# Altium schematic sheet Led Strip 2 colors.SchDoc
size A4
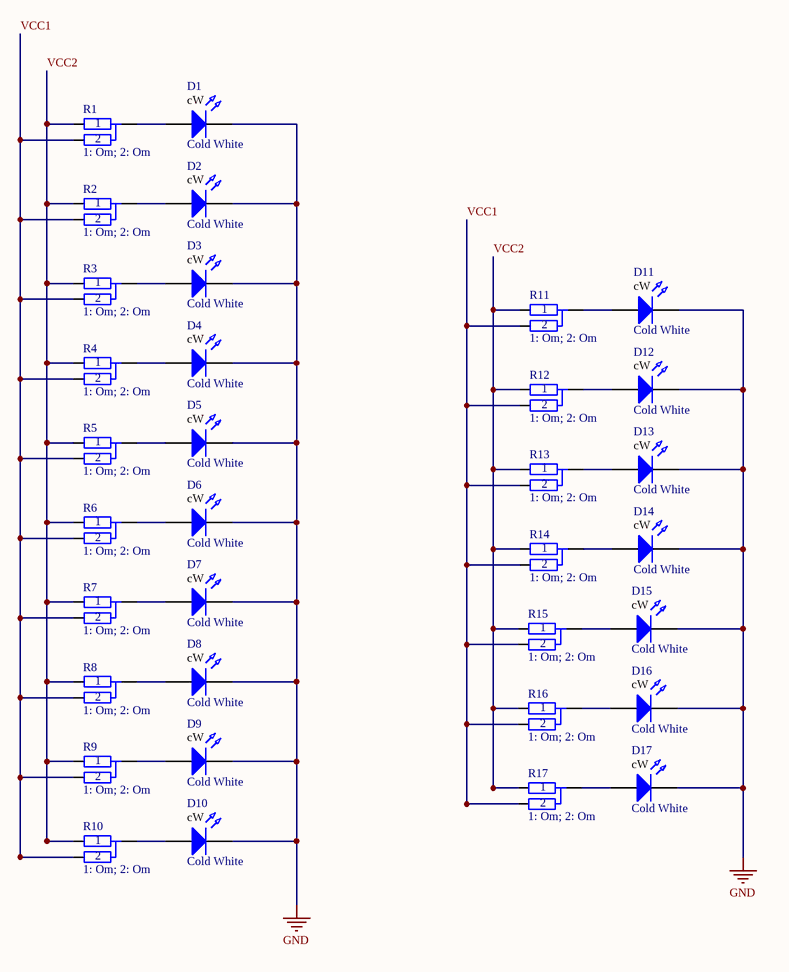
[diagram p0: Led Strip 2 colors.SchDoc]

## Parts
D1  Cold White  [LED SMD 5050 White compact R]
D2  Cold White  [LED SMD 5050 White compact R]
D3  Cold White  [LED SMD 5050 White compact R]
D4  Cold White  [LED SMD 5050 White compact R]
D5  Cold White  [LED SMD 5050 White compact R]
D6  Cold White  [LED SMD 5050 White compact R]
D7  Cold White  [LED SMD 5050 White compact R]
D8  Cold White  [LED SMD 5050 White compact R]
D9  Cold White  [LED SMD 5050 White compact R]
D10  Cold White  [LED SMD 5050 White compact R]
D11  Cold White  [LED SMD 5050 White compact R]
D12  Cold White  [LED SMD 5050 White compact R]
D13  Cold White  [LED SMD 5050 White compact R]
D14  Cold White  [LED SMD 5050 White compact R]
D15  Cold White  [LED SMD 5050 White compact R]
D16  Cold White  [LED SMD 5050 White compact R]
D17  Cold White  [LED SMD 5050 White compact R]
R1  1: Om; 2: Om  [SMD 0805 (2012) Double]
R2  1: Om; 2: Om  [SMD 0805 (2012) Double]
R3  1: Om; 2: Om  [SMD 0805 (2012) Double]
R4  1: Om; 2: Om  [SMD 0805 (2012) Double]
R5  1: Om; 2: Om  [SMD 0805 (2012) Double]
R6  1: Om; 2: Om  [SMD 0805 (2012) Double]
R7  1: Om; 2: Om  [SMD 0805 (2012) Double]
R8  1: Om; 2: Om  [SMD 0805 (2012) Double]
R9  1: Om; 2: Om  [SMD 0805 (2012) Double]
R10  1: Om; 2: Om  [SMD 0805 (2012) Double]
R11  1: Om; 2: Om  [SMD 0805 (2012) Double]
R12  1: Om; 2: Om  [SMD 0805 (2012) Double]
R13  1: Om; 2: Om  [SMD 0805 (2012) Double]
R14  1: Om; 2: Om  [SMD 0805 (2012) Double]
R15  1: Om; 2: Om  [SMD 0805 (2012) Double]
R16  1: Om; 2: Om  [SMD 0805 (2012) Double]
R17  1: Om; 2: Om  [SMD 0805 (2012) Double]

## Nets
GND: D1.K D2.K D3.K D4.K D5.K D6.K D7.K D8.K D9.K D10.K D11.K D12.K D13.K D14.K D15.K D16.K D17.K
VCC1: R1.2 R2.2 R3.2 R4.2 R5.2 R6.2 R7.2 R8.2 R9.2 R10.2 R11.2 R12.2 R13.2 R14.2 R15.2 R16.2 R17.2
VCC2: R1.1 R2.1 R3.1 R4.1 R5.1 R6.1 R7.1 R8.1 R9.1 R10.1 R11.1 R12.1 R13.1 R14.1 R15.1 R16.1 R17.1
NetD1_A: D1.A R1.3
NetD2_A: D2.A R2.3
NetD3_A: D3.A R3.3
NetD4_A: D4.A R4.3
NetD5_A: D5.A R5.3
NetD6_A: D6.A R6.3
NetD7_A: D7.A R7.3
NetD8_A: D8.A R8.3
NetD9_A: D9.A R9.3
NetD10_A: D10.A R10.3
NetD11_A: D11.A R11.3
NetD12_A: D12.A R12.3
NetD13_A: D13.A R13.3
NetD14_A: D14.A R14.3
NetD15_A: D15.A R15.3
NetD16_A: D16.A R16.3
NetD17_A: D17.A R17.3

## Notes on the sheet
- (in symbol Led SMD White Cold) cW

## Library data of the parts
D1-D17 = Led SMD White Cold: ?3v ?20mA; Forward Voltage TYP: ?3; Resistor for 5v VCC: 240 Om; Forward Voltage Min: ?; Wave len min/typ: ?; Liminous Min (mcd): ?; Liminous Typ (mcd): ?; Forward Amp (mA): ?; Color: Cold White
R1-R17 = Res SMD (Select one way): Choice from two resistors